# EAGLE design TIA2_4ch (EAGLE 7.5.0)
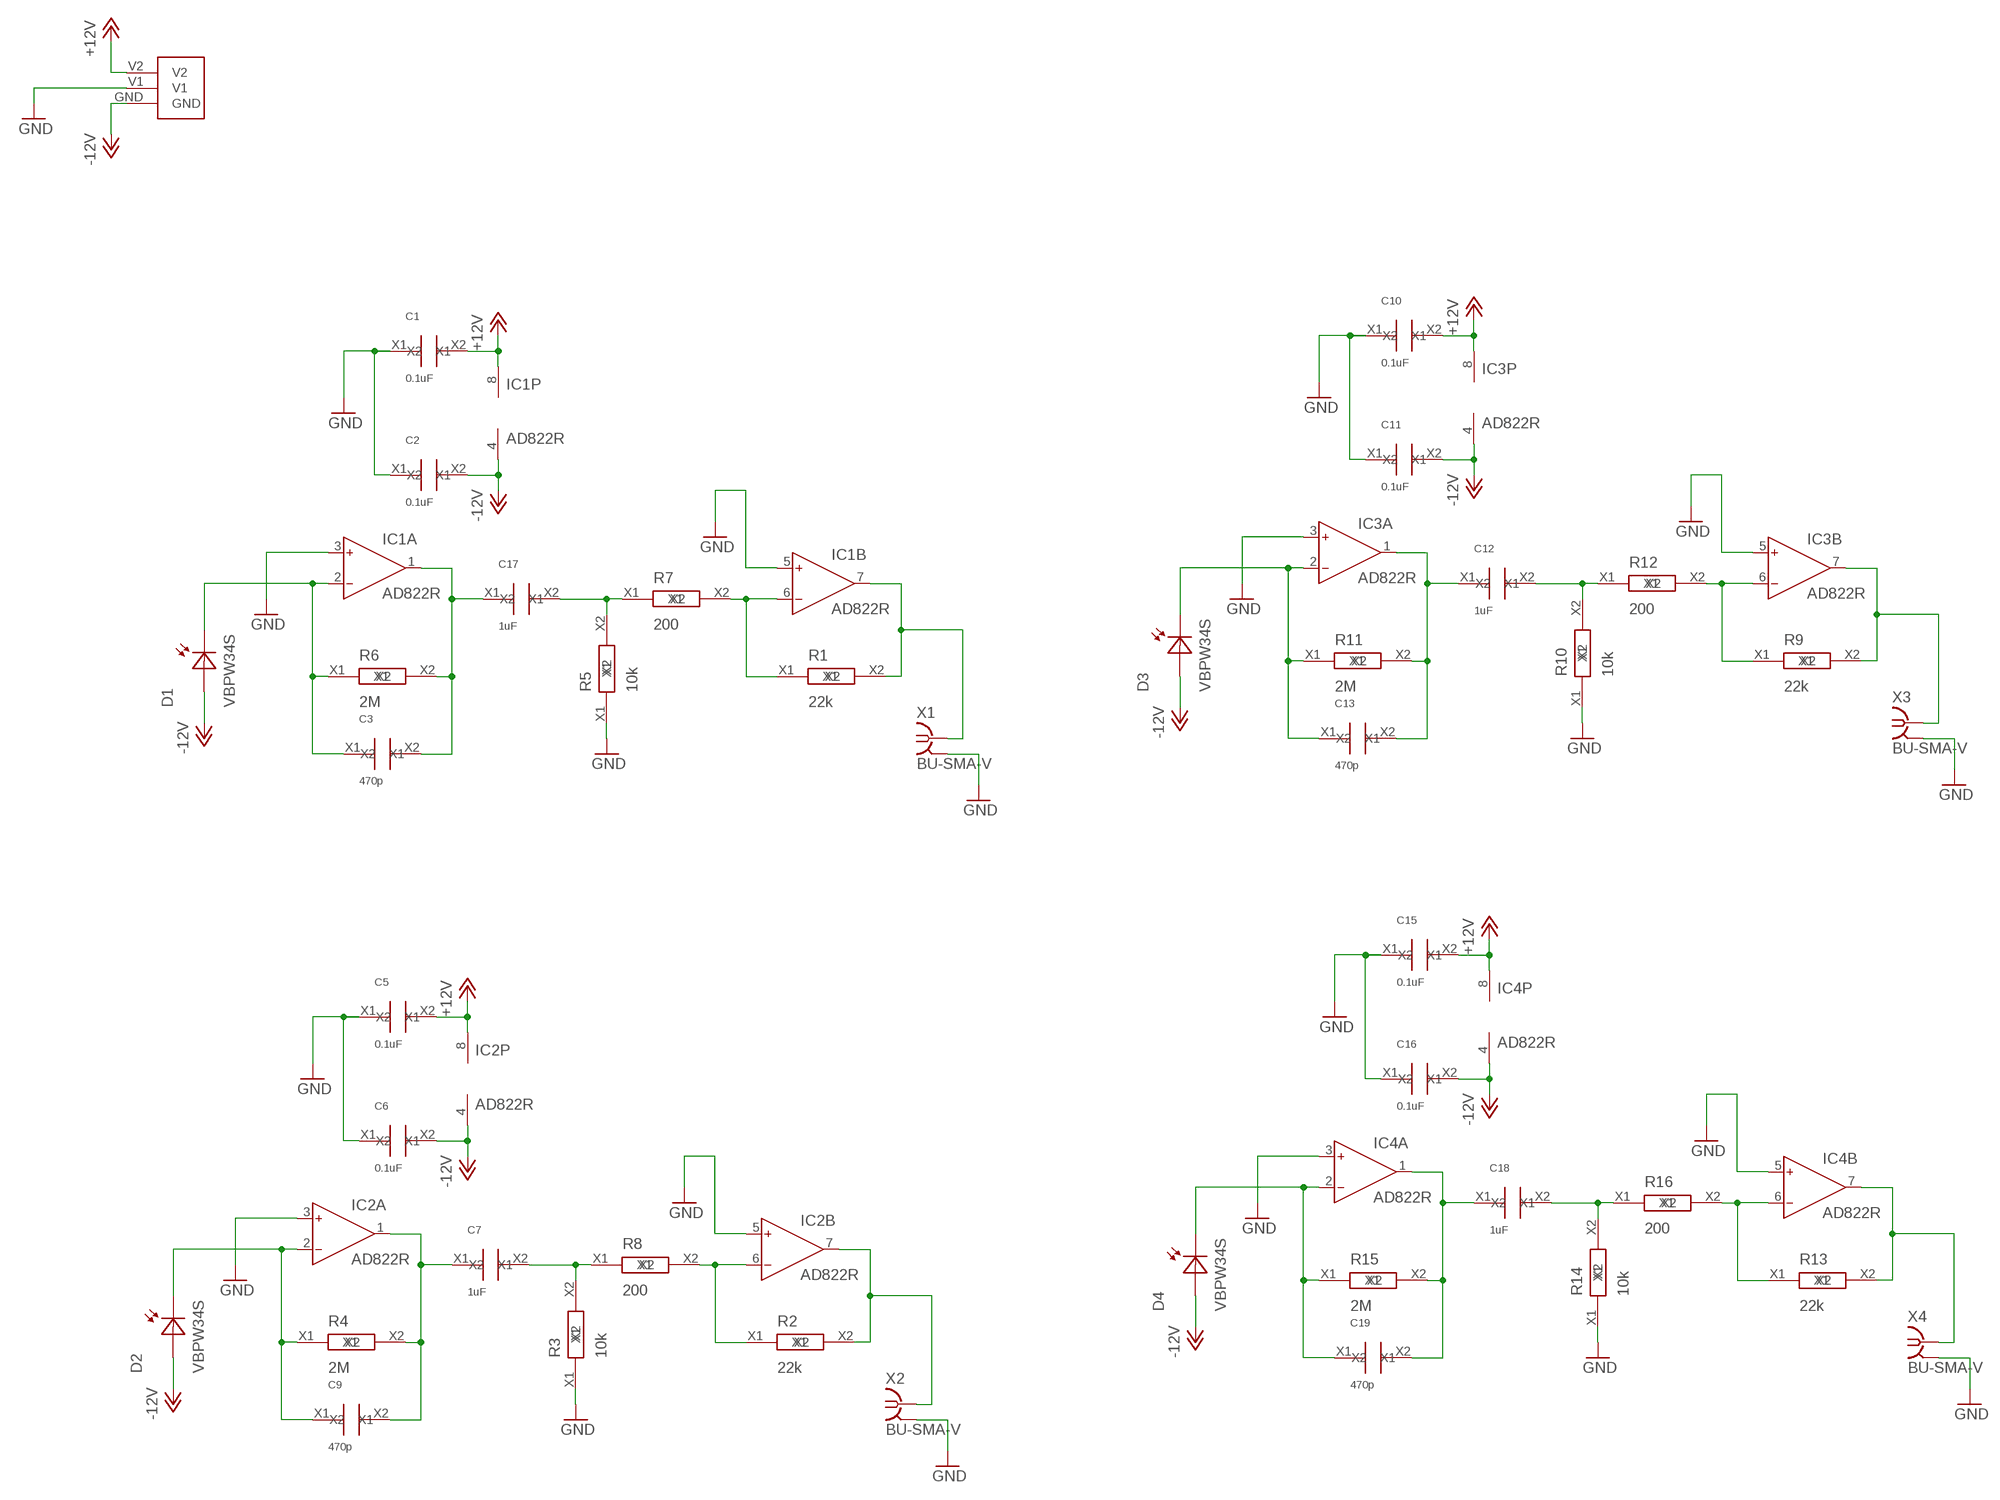
[diagram p0: schematic, sheet 1]

## Parts
C1  0.1uF  C_SMD_2.1X1.25  [SMD_2.1X1.25]
C2  0.1uF  C_SMD_2.1X1.25  [SMD_2.1X1.25]
C3  470p  C_SMD_2.1X1.25  [SMD_2.1X1.25]
C5  0.1uF  C_SMD_2.1X1.25  [SMD_2.1X1.25]
C6  0.1uF  C_SMD_2.1X1.25  [SMD_2.1X1.25]
C7  1uF  C_SMD_2.1X1.25  [SMD_2.1X1.25]
C9  470p  C_SMD_2.1X1.25  [SMD_2.1X1.25]
C10  0.1uF  C_SMD_2.1X1.25  [SMD_2.1X1.25]
C11  0.1uF  C_SMD_2.1X1.25  [SMD_2.1X1.25]
C12  1uF  C_SMD_2.1X1.25  [SMD_2.1X1.25]
C13  470p  C_SMD_2.1X1.25  [SMD_2.1X1.25]
C15  0.1uF  C_SMD_2.1X1.25  [SMD_2.1X1.25]
C16  0.1uF  C_SMD_2.1X1.25  [SMD_2.1X1.25]
C17  1uF  C_SMD_2.1X1.25  [SMD_2.1X1.25]
C18  1uF  C_SMD_2.1X1.25  [SMD_2.1X1.25]
C19  470p  C_SMD_2.1X1.25  [SMD_2.1X1.25]
D1  VBPW34S  [SOD6439X130N]
D2  VBPW34S  [SOD6439X130N]
D3  VBPW34S  [SOD6439X130N]
D4  VBPW34S  [SOD6439X130N]
IC1  AD822R  [SO8]
IC2  AD822R  [SO8]
IC3  AD822R  [SO8]
IC4  AD822R  [SO8]
R1  22k  R_SMD_2.1X1.25  [SMD_2.1X1.25]
R2  22k  R_SMD_2.1X1.25  [SMD_2.1X1.25]
R3  10k  R_SMD_2.1X1.25  [SMD_2.1X1.25]
R4  2M  R_SMD_2.1X1.25  [SMD_2.1X1.25]
R5  10k  R_SMD_2.1X1.25  [SMD_2.1X1.25]
R6  2M  R_SMD_2.1X1.25  [SMD_2.1X1.25]
R7  200  R_SMD_2.1X1.25  [SMD_2.1X1.25]
R8  200  R_SMD_2.1X1.25  [SMD_2.1X1.25]
R9  22k  R_SMD_2.1X1.25  [SMD_2.1X1.25]
R10  10k  R_SMD_2.1X1.25  [SMD_2.1X1.25]
R11  2M  R_SMD_2.1X1.25  [SMD_2.1X1.25]
R12  200  R_SMD_2.1X1.25  [SMD_2.1X1.25]
R13  22k  R_SMD_2.1X1.25  [SMD_2.1X1.25]
R14  10k  R_SMD_2.1X1.25  [SMD_2.1X1.25]
R15  2M  R_SMD_2.1X1.25  [SMD_2.1X1.25]
R16  200  R_SMD_2.1X1.25  [SMD_2.1X1.25]
U$1  BAT3_PLUG  [BAT3_PLUG]
X1  BU-SMA-V  [BU-SMA-V]
X2  BU-SMA-V  [BU-SMA-V]
X3  BU-SMA-V  [BU-SMA-V]
X4  BU-SMA-V  [BU-SMA-V]

## Nets
+12V: C1.X2 C5.X2 C10.X2 C15.X2 IC1.8(P:V+) IC2.8(P:V+) IC3.8(P:V+) IC4.8(P:V+) U$1.V2
-12V: C2.X2 C6.X2 C11.X2 C16.X2 D1.A D2.A D3.A D4.A IC1.4(P:V-) IC2.4(P:V-) IC3.4(P:V-) IC4.4(P:V-) U$1.GND
GND: C1.X1 C2.X1 C5.X1 C6.X1 C10.X1 C11.X1 C15.X1 C16.X1 IC1.3(A:IN+) IC1.5(B:IN+) IC2.3(A:IN+) IC2.5(B:IN+) IC3.3(A:IN+) IC3.5(B:IN+) IC4.3(A:IN+) IC4.5(B:IN+) R3.X1 R5.X1 R10.X1 R14.X1 U$1.V1 X1.2 X1.3 X1.4 X1.5 X2.2 X2.3 X2.4 X2.5 X3.2 X3.3 X3.4 X3.5 X4.2 X4.3 X4.4 X4.5
N$1: IC2.6(B:IN-) R2.X1 R8.X2
N$2: IC2.7(B:OUT) R2.X2 X2.1
N$3: IC1.6(B:IN-) R1.X1 R7.X2
N$4: IC1.7(B:OUT) R1.X2 X1.1
N$5: C7.X2 R3.X2 R8.X1
N$6: C9.X1 D2.C IC2.2(A:IN-) R4.X1
N$7: C7.X1 C9.X2 IC2.1(A:OUT) R4.X2
N$8: IC3.6(B:IN-) R9.X1 R12.X2
N$9: IC3.7(B:OUT) R9.X2 X3.1
N$10: C12.X2 R10.X2 R12.X1
N$11: C13.X1 D3.C IC3.2(A:IN-) R11.X1
N$12: C12.X1 C13.X2 IC3.1(A:OUT) R11.X2
N$13: IC4.6(B:IN-) R13.X1 R16.X2
N$14: IC4.7(B:OUT) R13.X2 X4.1
N$15: C18.X2 R14.X2 R16.X1
N$16: C19.X1 D4.C IC4.2(A:IN-) R15.X1
N$17: C17.X2 R5.X2 R7.X1
N$18: C3.X1 D1.C IC1.2(A:IN-) R6.X1
N$19: C3.X2 C17.X1 IC1.1(A:OUT) R6.X2
N$20: C18.X1 C19.X2 IC4.1(A:OUT) R15.X2

## Library data of the parts
C1-C3 C5-C7 C9-C13 C15-C19 = MyPowerComponents:C_SMD_2.1X1.25
D1-D4 = VBPW34S:VBPW34S: VBPW34SR Series 60 V 940 nm 50 mA 215 mW Surface Mount Silicon PIN Photodiode; DESCRIPTION: VBPW34SR Series 60 V 940 nm 50 mA 215 mW Surface Mount Silicon PIN Photodiode; DIGI-KEY_PART_NUMBER: 751-1500-1-ND; DIGI-KEY_PURCHASE_URL: https://www.digikey.ru/product-detail/en/vishay-semiconductor-opto-division/VBPW34S/751-1500-1-ND/2354866?utm_source=snapeda&utm_medium=aggregator&utm_campaign=symbol; MF: Vishay; MP: VBPW34S; PACKAGE: SMD-2 Vishay
IC1-IC4 = analog-devices:AD822: Single-Supply, Rail-to-Rail Low Power FET-Input Op Amp Source: http://www.analog.com/static/imported-files/data_sheets/AD822.pdf; MF: ANALOG DEVICES; MPN: AD822BRZ; OC_FARNELL: 1651303
R1-R16 = MyPowerComponents:R_SMD_2.1X1.25
U$1 = MyDuino:BAT3_PLUG
X1-X4 = con-coax:BU-SMA-V: FEMALE SMA CONNECTOR Radiall distributor RS 112-3794; OC_FARNELL: unknown; OC_NEWARK: unknown

## Board
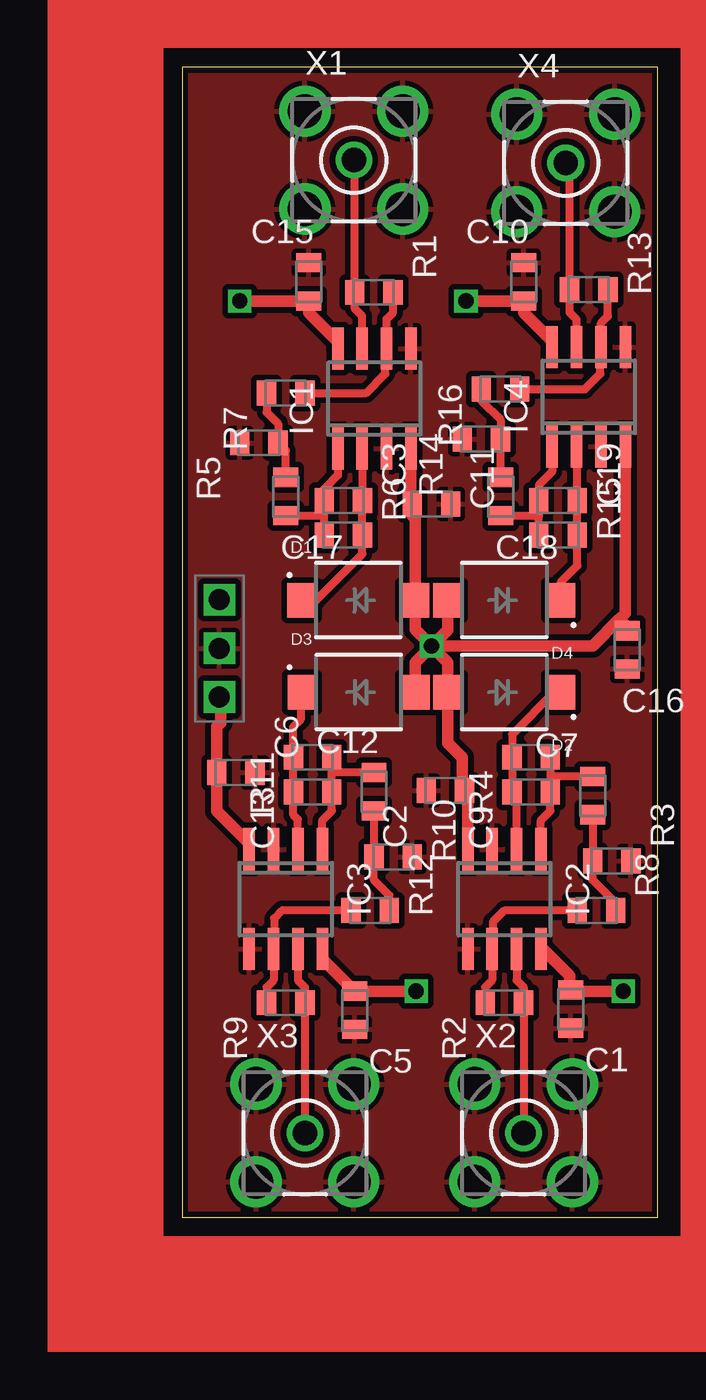
[diagram p1: board, top side]
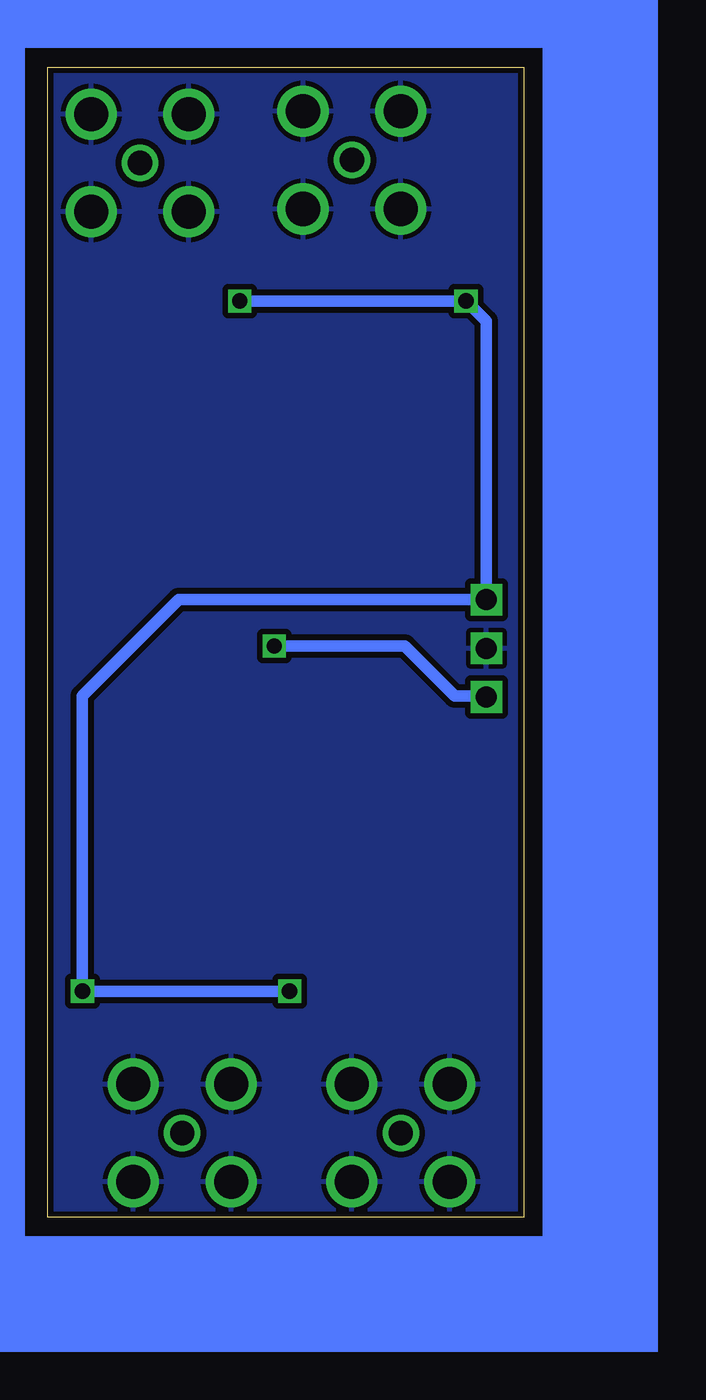
[diagram p2: board, bottom side, seen from below]

Size 24.8 x 60 mm. Coordinates in mm from the lower left corner, seen from the top.
Outline: 0,0 24.8,0 24.8,60 0,60 0,0
Copper layers (1*16): Top 0.035mm / dielectric 1.5mm / Bottom 0.035mm
Design rules "default *": minimum track width 10mil, minimum drill 24mil, track to track 8mil, track to pad 8mil, pad to pad 8mil, via to via 8mil, smd to smd 8mil, copper to edge 10mil, drill to drill 8mil, minimum pad ring 10mil, minimum via ring 8mil, stop-mask expansion 4mil, vias tented up to drill 0mil, thermal gap 10mil

### Footprints (pad centres in the part's own frame; a part is rotated, then mirrored left to right if it is on the bottom)
SMD_2.1X1.25 = smd 1.3 x 1: X1 0,1; X2 0,-1
SOD6439X130N = smd 1.5 x 1.8: A 2.95,0; C -2.95,0
SO8 = smd 0.6 x 2.2: 1 -1.905,-2.6; 2 -0.635,-2.6; 3 0.635,-2.6; 4 1.905,-2.6; 5 1.905,2.6; 6 0.635,2.6; 7 -0.635,2.6; 8 -1.905,2.6
BAT3_PLUG = drill 1.1 square: GND 0,-2.54; V1 0,0; V2 0,2.54
BU-SMA-V = drill 1.27: 1 0,0 | drill 1.778: 2 -2.55,2.55; 3 2.55,2.55; 4 2.55,-2.55; 5 -2.55,-2.55

### Placement (x,y rotation side)
C1  20.27,10.87 180 top
C2  13.72,22.27 90 top
C3  8.4,37.4 270 top
C5  9,10.8 180 top
C6  2.8,23.2 270 top
C7  21.4,22 0 top
C9  18.2,22.2 90 top
C10  17.8,48.8 0 top
C11  13,37.2 270 top
C12  10,22.2 0 top
C13  6.8,22.2 90 top
C15  6.6,48.8 0 top
C16  23.2,29.6 180 top
C17  5.4,37.6 180 top
C18  16.6,37.6 180 top
C19  19.6,37.4 270 top
D1  9.19,32.2 0 top
D2  16.8,27.4 180 top
D3  9.2,27.4 0 top
D4  16.8,32.2 180 top
IC1  10.02,42.71 0 top
IC2  16.8,16.6 180 top
IC3  5.4,16.6 180 top
IC4  21.2,42.8 0 top
R1  9.99,48.25 270 top
R2  16.8,11.2 90 top
R3  22.4,18.6 270 top
R4  18.2,24 90 top
R5  4,40.4 90 top
R6  8.4,35.6 270 top
R7  5.4,43 90 top
R8  21.6,16 270 top
R9  5.4,11.2 90 top
R10  11,18.8 270 top
R11  6.8,24 90 top
R12  9.8,16 270 top
R13  21.2,48.4 270 top
R14  15.6,40.6 90 top
R15  19.6,35.6 270 top
R16  16.6,43.2 90 top
U$1  1.94,29.68 0 top
X1  8.95,55.15 0 top
X2  17.8,4.4 0 top
X3  6.4,4.4 0 top
X4  20,55 0 top

### Tracks (layer width: path | path; a pad name or v marks a point on that pad's centre or on a via)
+12V  (via drill 0.8)
  Top 0.61: IC2.8 18.8,14 20.2,12.6 20.2,11.94 C1.X2 20.34,11.8 v23,11.8 | IC3.8 7.3,13.49 C5.X2 v12.2,11.8 | IC1.8 8.12,45.69 6.6,47.2 C15.X2 v3,47.8 | IC4.8 19.3,45.7 17.8,47.2 17.8,47.6 | 17.8,47.6 C10.X2 | 17.8,47.6 17.6,47.8 v14.8,47.8
  Bottom 0.61: v14.8,47.8 v3,47.8 1.94,46.74 U$1.V2 17.98,32.22 23,27.2 v23,11.8 v12.2,11.8
-12V  (via drill 0.8)
  Top 0.61: U$1.GND 2,27.08 2,25.8 1.8,25.6 C6.X2 1.8,21.2 3.5,19.5 IC3.4 | v13,29.8 12.14,30.66 D1.A 12.14,36.46 12,36.6 C11.X2 11.93,37.27 IC1.4 | D4.A 13.85,30.65 v13,29.8 | D3.A 12.15,28.95 v13,29.8 | v13,29.8 13.85,28.95 D2.A 13.85,24.75 14.6,24 14.6,22.39 C2.X2 14.89,22.09 IC2.4 | IC4.4 23.11,31.5 22.8,31.2 | 22.8,31.2 21.4,29.8 v13,29.8 | C16.X2 23.2,30.8 22.8,31.2
  Bottom 0.61: v13,29.8 6.2,29.8 3.6,27.2 2,27.2 U$1.GND
GND
  pour Bottom (isolate 0.305): 0,0 25,0 25,60 0,60
  pour Top (isolate 0.305): 0,0 25,0 25,60 0,60
N$1
  Top 0.406: R8.X2 16.8,16 16.2,15.4 16.2,14.04 IC2.6 16.16,12.37 15.8,12 R2.X1
N$2
  Top 0.406: IC2.7 17.43,12.37 17.8,12 R2.X2 X2.1
N$3
  Top 0.406: R7.X2 9.6,43 10.6,44 10.6,45.26 IC1.6 10.65,46.85 11,47.2 R1.X1
N$4
  Top 0.406: X1.1 8.99,55.11 R1.X2 9,47.4 9.38,47.02 IC1.7
N$5
  Top 0.406: C7.X2 R3.X2 21.4,17.6 22.6,16.4 R8.X1
N$6
  Top 0.406: IC2.2 17.43,21.96 C9.X1 R4.X1 17.2,25.2 19.4,27.4 D2.C
N$7
  Top 0.406: R4.X2 19.2,23 | 19.2,23 C9.X2 19.2,21.2 18.7,20.7 IC2.1 | C7.X1 19.2,23
N$8
  Top 0.406: R9.X1 4.4,12 4.76,12.37 IC3.6 4.8,14.04 4.8,15.6 5.2,16 R12.X2
N$9
  Top 0.406: X3.1 R9.X2 6.4,12 6.04,12.37 IC3.7
N$10
  Top 0.406: C12.X2 R10.X2 10,17.6 10.8,16.8 R12.X1
N$11
  Top 0.406: IC3.2 6.04,20.77 5.8,21 C13.X1 R11.X1 5.8,25.6 6.2,26 6.2,27.35 D3.C
N$12
  Top 0.406: IC3.1 7.3,20.7 7.8,21.2 C13.X2 7.8,23.2 | 7.8,23.2 R11.X2 | C12.X1 7.8,23.2
N$13
  Top 0.406: R13.X1 22.2,47 21.84,46.63 IC4.6 21.8,45.37 21.8,44 21,43.2 R16.X2
N$14
  Top 0.406: IC4.7 20.57,46.84 20.2,47.2 R13.X2 20.2,54.8 X4.1
N$15
  Top 0.406: C18.X2 R14.X2 16.6,41.6 15.6,42.6 R16.X1
N$16
  Top 0.406: D4.C 19.75,33.15 20.6,34 R15.X1 C19.X1 20.57,37.44 IC4.2
N$17
  Top 0.406: C17.X2 5.4,40 R5.X2 5,41.4 4.4,42 R7.X1
N$18
  Top 0.406: D1.C 7,32.2 9.4,34.6 R6.X1 C3.X1 9.38,37.41 IC1.2
N$19
  Top 0.406: R6.X2 7.4,36.6 | 7.4,36.6 C3.X2 7.4,38 8.12,38.72 IC1.1 | C17.X1 7.4,36.6
N$20
  Top 0.406: R15.X2 18.6,36.6 | 18.6,36.6 C19.X2 18.6,38.2 19.3,38.9 IC4.1 | C18.X1 18.6,36.6
(copper drawn outside any net)
  shapes: Bottom area x6, Top area x5